# EasyEDA Pro project SK_MFB滤波器.eprj

# Schematic Schematic1
Board Name: Board1; Create Date: 2024-11-27; Page Name: P1; Project Name: SK_MFB滤波器; Schematic Name: Schematic1; Update Date: 2025-03-05; Company: 嘉立创EDA; Page Size: A4; Version: V1.0
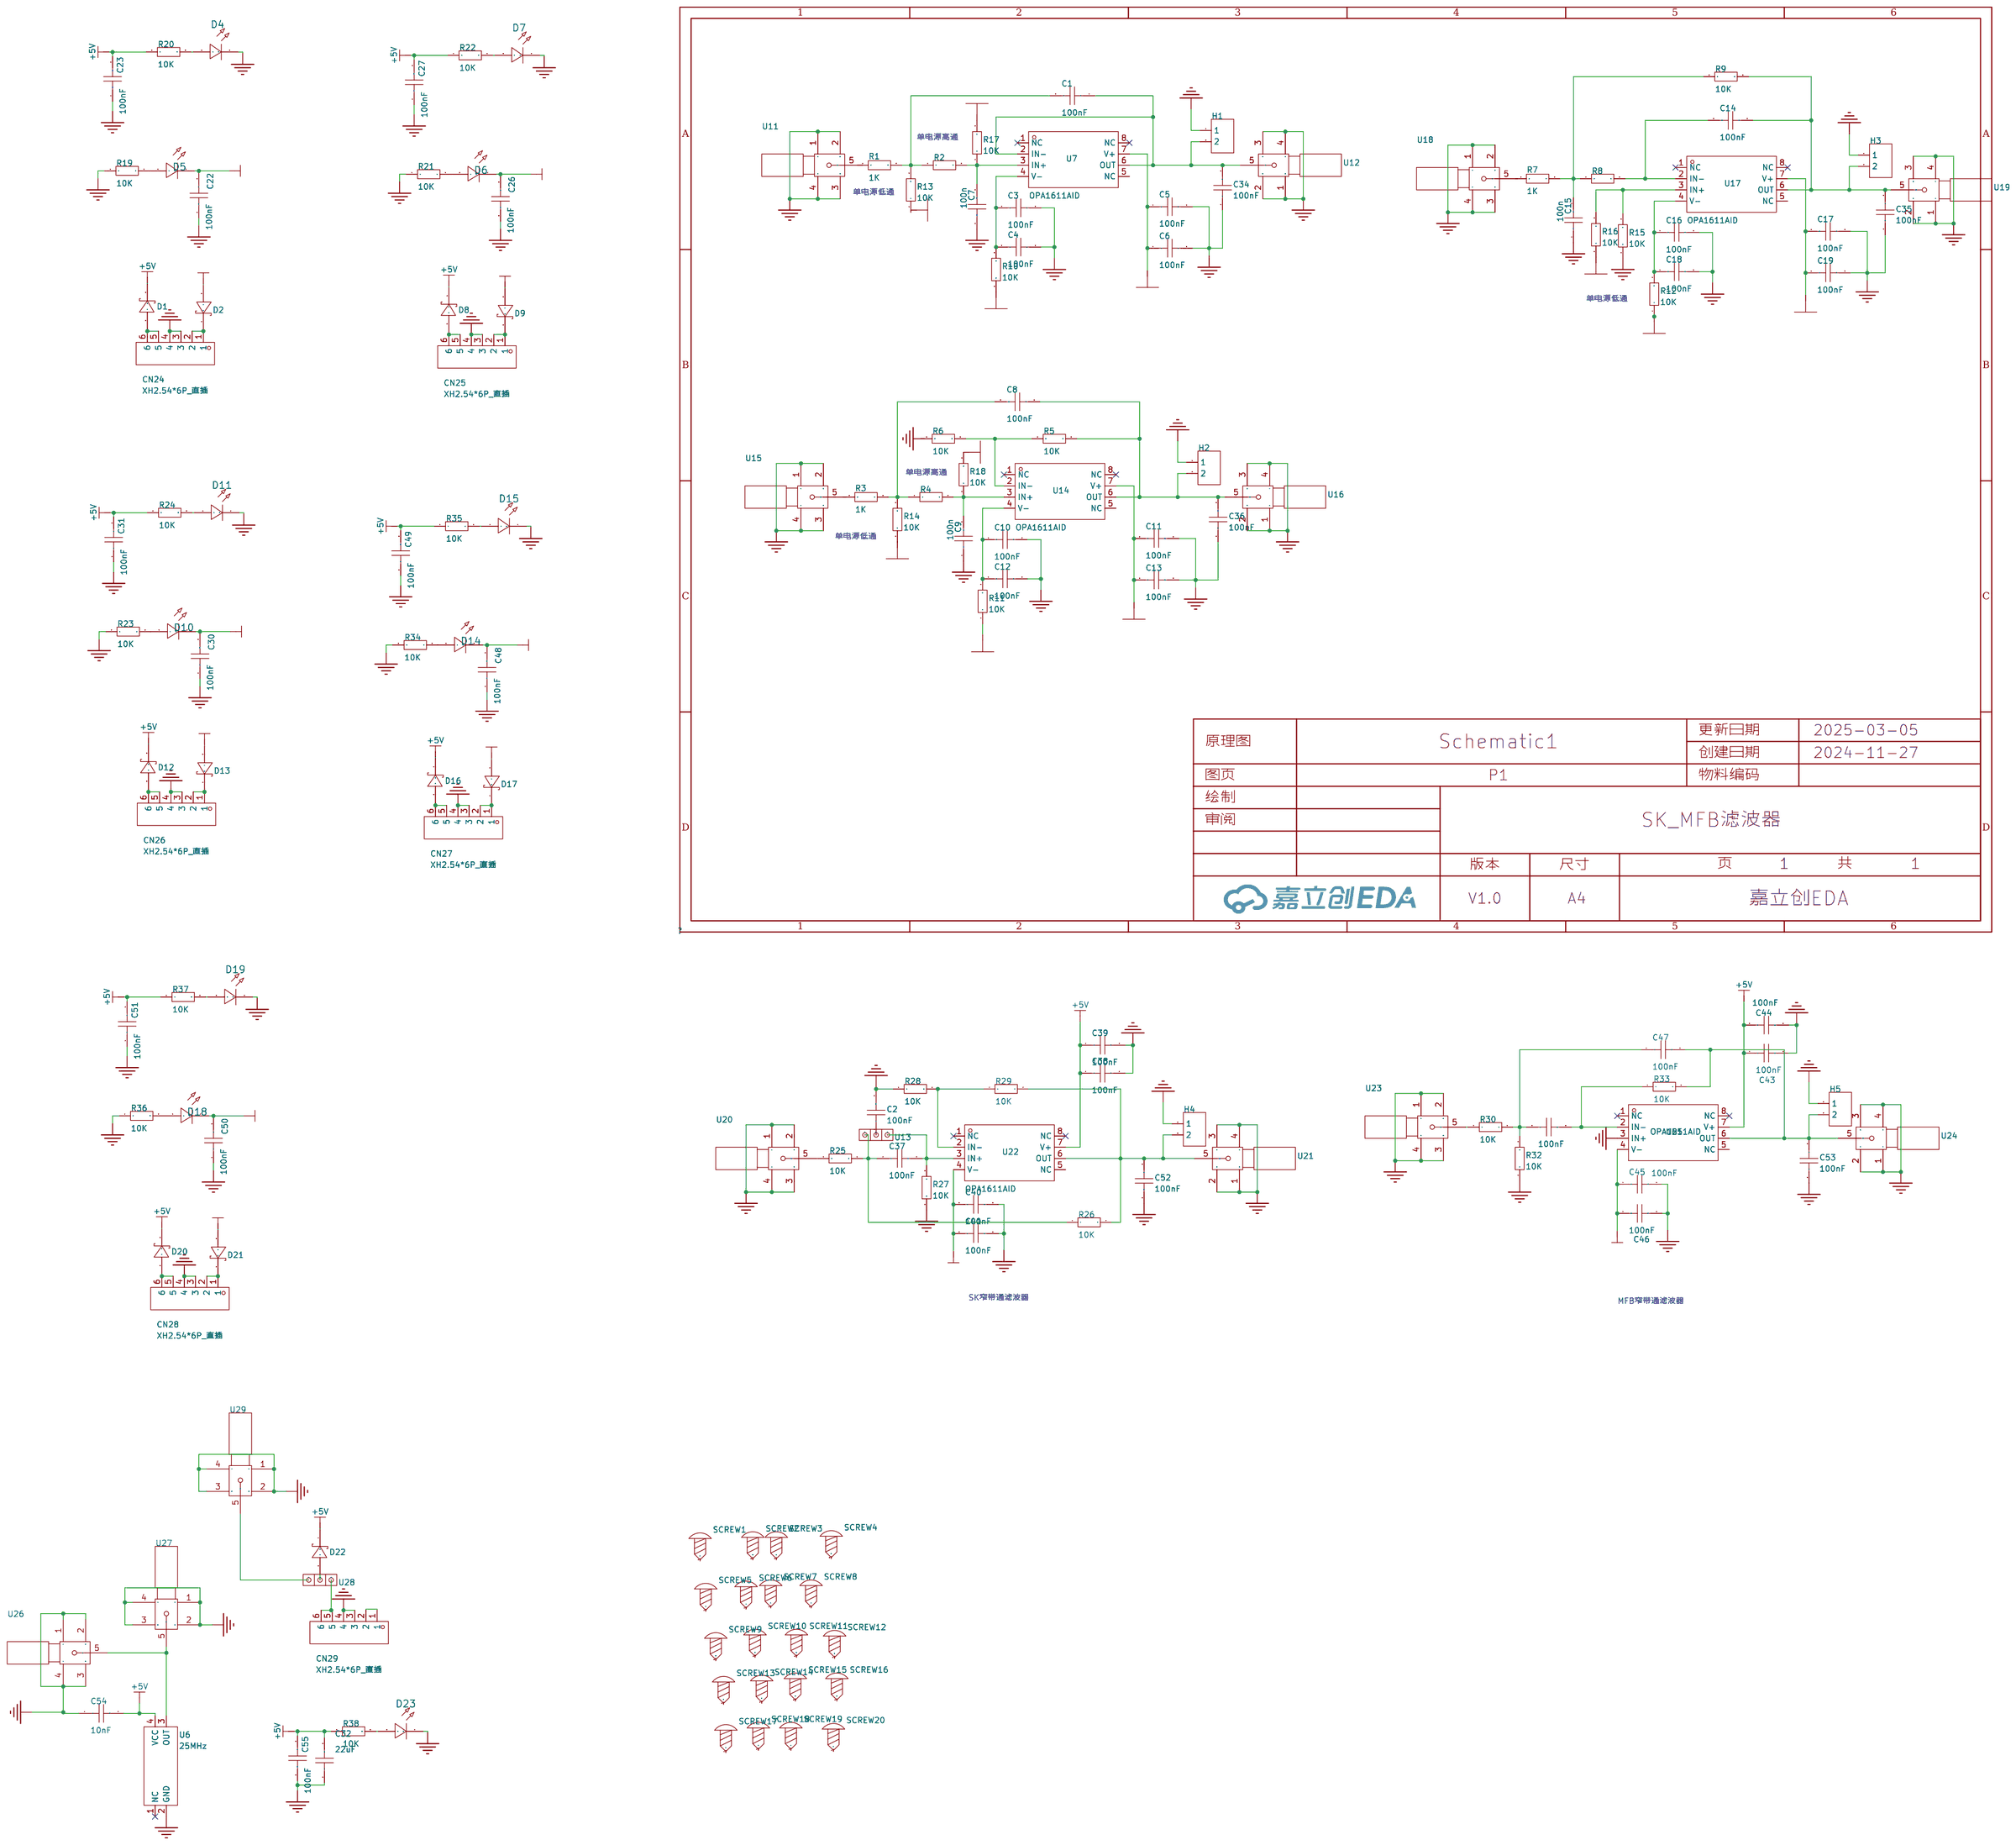
[diagram p0: schematic sheet]

## Parts
C1  100nF  [R0805]
C2  100nF  [R0805]
C3  100nF  [R0805]
C4  100nF  [R0805]
C5  100nF  [R0805]
C6  100nF  [R0805]
C7  100n  [R0805]
C8  100nF  [R0805]
C9  100n  [R0805]
C10  100nF  [R0805]
C11  100nF  [R0805]
C12  100nF  [R0805]
C13  100nF  [R0805]
C14  100nF  [R0805]
C15  100n  [R0805]
C16  100nF  [R0805]
C17  100nF  [R0805]
C18  100nF  [R0805]
C19  100nF  [R0805]
C22  100nF  [R0805]
C23  100nF  [R0805]
C26  100nF  [R0805]
C27  100nF  [R0805]
C30  100nF  [R0805]
C31  100nF  [R0805]
C32  22uF  [C1210]
C34  100nF  [R0805]
C35  100nF  [R0805]
C36  100nF  [R0805]
C37  100nF  [R0805]
C38  100nF  [R0805]
C39  100nF  [R0805]
C40  100nF  [R0805]
C41  100nF  [R0805]
C42  100nF  [R0805]
C43  100nF  [R0805]
C44  100nF  [R0805]
C45  100nF  [R0805]
C46  100nF  [R0805]
C47  100nF  [R0805]
C48  100nF  [R0805]
C49  100nF  [R0805]
C50  100nF  [R0805]
C51  100nF  [R0805]
C52  100nF  [R0805]
C53  100nF  [R0805]
C54  10nF  [R0805]
C55  100nF  [R0805]
CN24  XH2.54*6P_直插  [CONN-TH_XH2.54-6P]
CN25  XH2.54*6P_直插  [CONN-TH_XH2.54-6P]
CN26  XH2.54*6P_直插  [CONN-TH_XH2.54-6P]
CN27  XH2.54*6P_直插  [CONN-TH_XH2.54-6P]
CN28  XH2.54*6P_直插  [CONN-TH_XH2.54-6P]
CN29  XH2.54*6P_直插  [CONN-TH_XH2.54-6P]
D1  SD103AWS  [SOD-323_L1.8-W1.3-LS2.5-RD]
D2  SD103AWS  [SOD-323_L1.8-W1.3-LS2.5-RD]
D4  -  [LED_0805]
D5  -  [LED_0805]
D6  -  [LED_0805]
D7  -  [LED_0805]
D8  SD103AWS  [SOD-323_L1.8-W1.3-LS2.5-RD]
D9  SD103AWS  [SOD-323_L1.8-W1.3-LS2.5-RD]
D10  -  [LED_0805]
D11  -  [LED_0805]
D12  SD103AWS  [SOD-323_L1.8-W1.3-LS2.5-RD]
D13  SD103AWS  [SOD-323_L1.8-W1.3-LS2.5-RD]
D14  -  [LED_0805]
D15  -  [LED_0805]
D16  SD103AWS  [SOD-323_L1.8-W1.3-LS2.5-RD]
D17  SD103AWS  [SOD-323_L1.8-W1.3-LS2.5-RD]
D18  -  [LED_0805]
D19  -  [LED_0805]
D20  SD103AWS  [SOD-323_L1.8-W1.3-LS2.5-RD]
D21  SD103AWS  [SOD-323_L1.8-W1.3-LS2.5-RD]
D22  SD103AWS  [SOD-323_L1.8-W1.3-LS2.5-RD]
D23  -  [LED_0805]
H1  -  [HDR-TH_2P-P2.54-V-F]
H2  -  [HDR-TH_2P-P2.54-V-F]
H3  -  [HDR-TH_2P-P2.54-V-F]
H4  -  [HDR-TH_2P-P2.54-V-F]
H5  -  [HDR-TH_2P-P2.54-V-F]
R1  1K  [R0805]
R2  1K  [R0805]
R3  1K  [R0805]
R4  1K  [R0805]
R5  10K  [R0805]
R6  10K  [R0805]
R7  1K  [R0805]
R8  1K  [R0805]
R9  10K  [R0805]
R10  10K  [R0805]
R11  10K  [R0805]
R12  10K  [R0805]
R13  10K  [R0805]
R14  10K  [R0805]
R15  10K  [R0805]
R16  10K  [R0805]
R17  10K  [R0805]
R18  10K  [R0805]
R19  10K  [R0805]
R20  10K  [R0805]
R21  10K  [R0805]
R22  10K  [R0805]
R23  10K  [R0805]
R24  10K  [R0805]
R25  10K  [R0805]
R26  10K  [R0805]
R27  10K  [R0805]
R28  10K  [R0805]
R29  10K  [R0805]
R30  10K  [R0805]
R32  10K  [R0805]
R33  10K  [R0805]
R34  10K  [R0805]
R35  10K  [R0805]
R36  10K  [R0805]
R37  10K  [R0805]
R38  10K  [R0805]
SCREW1  -  [M3螺丝]
SCREW2  -  [M3螺丝]
SCREW3  -  [M3螺丝]
SCREW4  -  [M3螺丝]
SCREW5  -  [M3螺丝]
SCREW6  -  [M3螺丝]
SCREW7  -  [M3螺丝]
SCREW8  -  [M3螺丝]
SCREW9  -  [M3螺丝]
SCREW10  -  [M3螺丝]
SCREW11  -  [M3螺丝]
SCREW12  -  [M3螺丝]
SCREW13  -  [M3螺丝]
SCREW14  -  [M3螺丝]
SCREW15  -  [M3螺丝]
SCREW16  -  [M3螺丝]
SCREW17  -  [M3螺丝]
SCREW18  -  [M3螺丝]
SCREW19  -  [M3螺丝]
SCREW20  -  [M3螺丝]
U6  25MHz  [OSC-SMD_4P-L7.0-W5.0-BL]
U7  OPA1611AID  [SOIC-8_L4.9-W3.9-P1.27-LS6.0-BL]
U11  -  [SMA]
U12  -  [SMA]
U13  -  [1*3跳线]
U14  OPA1611AID  [SOIC-8_L4.9-W3.9-P1.27-LS6.0-BL]
U15  -  [SMA]
U16  -  [SMA]
U17  OPA1611AID  [SOIC-8_L4.9-W3.9-P1.27-LS6.0-BL]
U18  -  [SMA]
U19  -  [SMA]
U20  -  [SMA]
U21  -  [SMA]
U22  OPA1611AID  [SOIC-8_L4.9-W3.9-P1.27-LS6.0-BL]
U23  -  [SMA]
U24  -  [SMA]
U25  OPA1611AID  [SOIC-8_L4.9-W3.9-P1.27-LS6.0-BL]
U26  -  [SMA]
U27  -  [SMA]
U28  -  [1*3跳线]
U29  -  [SMA]

## Library data of the parts
C1-C19 C22 C23 C26 C27 C30 C31 C34-C55 = CAP_0805: Supplier Footprint: 0805
C32 = CL32B226KAJNNNE: 容值:22uF;精度:±10%;额定电压:25V;材质(温度系数):X7R;; LCSC Part Name: 22uF ±10% 25V; Supplier Part: C309062; Manufacturer: SAMSUNG(三星); Supplier Footprint: 1210; JLCPCB Part Class: 扩展库; Datasheet: https://atta.szlcsc.com/upload/public/pdf/source/20160218/1457707763339.pdf; Supplier: LCSC; Tolerance: ±10%; Voltage Rated: 25V; Temperature Coefficient: X7R
CN24-CN29 = XH2.54*6P_直插: Supplier Part: C9900008614; Supplier Footprint: XH2.54_6P; JLCPCB Part Class: 扩展库; Supplier: LCSC
D1 D2 D8 D9 D12 D13 D16 D17 D20-D22 = SD103AWS_C181207: 正向压降(Vf):600mV@200mA;直流反向耐压(Vr):40V;整流电流:350mA;; LCSC Part Name: 电压:40V 电流:350mA 丝印S4; Supplier Part: C181207; Manufacturer: Hottech(合科泰); Supplier Footprint: SOD-323; JLCPCB Part Class: 扩展库; Datasheet: https://atta.szlcsc.com/upload/public/pdf/source/20240513/4691873FBB9173EFBCF4C6FD4BBA1025.pdf; Supplier: LCSC; Forward Voltage (Vf@If): 600mV@200mA; Reverse Voltage (Vr): 40V; Rectified Current: 350mA
D4-D7 D10 D11 D14 D15 D18 D19 D23 = LED_0805-R: Supplier Footprint: 0805
H1-H5 = HDR-F_2.54_1x2P: Supplier Part: C49661; Supplier Footprint: 插件
R1-R30 R32-R38 = Res_0805: Supplier Footprint: 0805
SCREW1-SCREW20 = M3螺丝: Supplier Footprint: 插件
U6 = CO75H4-25.000-33GDTST: 频率:25MHz;输出模式:HCMOS;工作电压:3.3V;频率稳定度(全温):±50ppm;; LCSC Part Name: 25MHz 3.3V HCMOS +/-10PPM; Supplier Part: C2905361; Manufacturer: HCI(杭晶); Supplier Footprint: SMD7050-4P; JLCPCB Part Class: 扩展库; Datasheet: https://atta.szlcsc.com/upload/public/pdf/source/20220525/8A5D6CFF436A3D6FB5711C1D3D06A199.pdf; Supplier: LCSC; Output Type: HCMOS; Supply Voltage: 3.3V; Frequency Stability(Full temperature range): ±50ppm; Operating Temperature: -40℃~+85℃
U7 U14 U17 U22 U25 = OPA1611AID: Supplier Part: C181405; Manufacturer: TI(德州仪器); Supplier Footprint: SOIC-8; JLCPCB Part Class: 扩展库; Datasheet: https://www.ti.com/cn/lit/gpn/opa1611; Supplier: LCSC; Speaker Channels: 单声道; Operating Temperature: -40℃~+85℃
U11 U12 U15 U16 U18-U21 U23 U24 U26 U27 U29 = SMA
U13 U28 = 1*3跳线

## Nets
+5V: C5.1 C6.1 C11.1 C13.1 C17.1 C19.1 C23.2 C27.2 C31.2 C32.2 C38.1 C39.1 C43.1 C44.1 C49.2 C51.2 C54.2 C55.2 D1.1(C) D8.1(C) D12.1(C) D16.1(C) D20.1(C) D22.1(C) R13.1 R14.1 R16.1 R17.2 R18.2 R20.1 R22.1 R24.1 R35.1 R37.1 R38.1 U6.4(VCC) U7.7(V+) U14.7(V+) U17.7(V+) U22.7(V+) U25.7(V+)
-5V: C22.2 C26.2 C30.2 C40.1 C41.1 C45.1 C46.1 C48.2 C50.2 D2.2(A) D5.1(C) D6.1(C) D9.2(A) D10.1(C) D13.2(A) D14.1(C) D17.2(A) D18.1(C) D21.2(A) R10.1 R11.1 R12.1 U22.4(V-) U25.4(V-)
GND: C2.2 C3.2 C4.2 C5.2 C6.2 C7.1 C9.1 C10.2 C11.2 C12.2 C13.2 C15.1 C16.2 C17.2 C18.2 C19.2 C22.1 C23.1 C26.1 C27.1 C30.1 C31.1 C32.1 C34.1 C35.1 C36.1 C38.2 C39.2 C40.2 C41.2 C43.2 C44.2 C45.2 C46.2 C48.1 C49.1 C50.1 C51.1 C52.1 C53.1 C54.1 C55.1 CN24.3 CN24.4 CN25.3 CN25.4 CN26.3 CN26.4 CN27.3 CN27.4 CN28.3 CN28.4 CN29.3 CN29.4 D4.1(C) D7.1(C) D11.1(C) D15.1(C) D19.1(C) D23.1(C) H1.1 H2.1 H3.1 H4.1 H5.1 R6.1 R15.1 R19.1 R21.1 R23.1 R27.1 R28.1 R32.1 R34.1 R36.1 U6.2(GND) U11.1 U11.2 U11.3 U11.4 U12.1 U12.2 U12.3 U12.4 U15.1 U15.2 U15.3 U15.4 U16.1 U16.2 U16.3 U16.4 U18.1 U18.2 U18.3 U18.4 U19.1 U19.2 U19.3 U19.4 U20.1 U20.2 U20.3 U20.4 U21.1 U21.2 U21.3 U21.4 U23.1 U23.2 U23.3 U23.4 U24.1 U24.2 U24.3 U24.4 U25.3(IN+) U26.1 U26.2 U26.3 U26.4 U27.1 U27.2 U27.3 U27.4 U29.1 U29.2 U29.3 U29.4
$1N3424: C3.1 C4.1 R10.2 U7.4(V-)
$1N4804: C7.2 R2.2 R17.1 U7.3(IN+)
$1N4936: R1.1 U11.5
$1N6332: C1.2 R1.2 R2.1 R13.2
$1N6624: C1.1 C34.2 H1.2 U7.2(IN-) U7.6(OUT) U12.5
$1N7112: R3.1 U15.5
$1N7126: C8.2 R3.2 R4.1 R14.2
$1N7131: C10.1 C12.1 R11.2 U14.4(V-)
$1N7132: C9.2 R4.2 R18.1 U14.3(IN+)
$1N7147: R5.1 R6.2 U14.2(IN-)
$1N7158: C8.1 C36.2 H2.2 R5.2 U14.6(OUT) U16.5
$1N8120: R7.1 U18.5
$1N8133: C15.2 R7.2 R8.1 R9.1
$1N8137: C14.2 R8.2 U17.2(IN-)
$1N8145: C14.1 C35.2 H3.2 R9.2 U17.6(OUT) U19.5
$1N8408: C16.1 C18.1 R12.2 U17.4(V-)
$1N8595: R15.2 R16.2 U17.3(IN+)
$1N9380: CN24.1 CN24.2 D2.1(C)
$1N9382: D4.2(A) R20.2
$1N9385: CN24.5 CN24.6 D1.2(A)
$1N9388: D5.2(A) R19.2
$1N9874: D6.2(A) R21.2
$1N9876: D7.2(A) R22.2
$1N9882: CN25.5 CN25.6 D8.2(A)
$1N9884: CN25.1 CN25.2 D9.1(C)
$1N10335: D10.2(A) R23.2
$1N10337: D11.2(A) R24.2
$1N10343: CN26.5 CN26.6 D12.2(A)
$1N10345: CN26.1 CN26.2 D13.1(C)
$1N11433: C42.2 R33.1 U25.2(IN-)
$1N11438: C42.1 C47.1 R30.2 R32.2
$1N11444: R30.1 U23.5
$1N11467: C47.2 C53.2 H5.2 R33.2 U24.5 U25.6(OUT)
$1N11477: C37.1 R25.2 R26.1 U13.1
$1N11484: R28.2 R29.1 U22.2(IN-)
$1N11488: C52.2 H4.2 R26.2 R29.2 U21.5 U22.6(OUT)
$1N11503: C37.2 R27.2 U13.3 U22.3(IN+)
$1N11520: C2.1 U13.2
$1N11527: R25.1 U20.5
$1N11915: CN27.5 CN27.6 D16.2(A)
$1N11916: CN27.1 CN27.2 D17.1(C)
$1N11925: D14.2(A) R34.2
$1N11929: D15.2(A) R35.2
$1N12302: CN28.5 CN28.6 D20.2(A)
$1N12303: CN28.1 CN28.2 D21.1(C)
$1N12312: D18.2(A) R36.2
$1N12316: D19.2(A) R37.2
$1N18614: D23.2(A) R38.2
$1N18618: CN29.1 CN29.2
$1N18622: U6.3(OUT) U26.5 U27.5
$1N18772: CN29.5 CN29.6 U28.3
$1N18775: D22.2(A) U28.2
$1N18865: U28.1 U29.5

Not connected (* = marked no-connect by the designer): SCREW1 1; SCREW2 1; SCREW3 1; SCREW4 1; SCREW5 1; SCREW6 1; SCREW7 1; SCREW8 1; SCREW9 1; SCREW10 1; SCREW11 1; SCREW12 1; SCREW13 1; SCREW14 1; SCREW15 1; SCREW16 1; SCREW17 1; SCREW18 1; SCREW19 1; SCREW20 1; U6 1(NC)*; U7 1(NC)* 5(NC) 8(NC)*; U14 1(NC)* 5(NC) 8(NC)*; U17 1(NC)* 5(NC) 8(NC)*; U22 1(NC)* 5(NC) 8(NC)*; U25 1(NC)* 5(NC) 8(NC)*

## Notes on the sheet
- 单电源高通
- 单电源低通
- 单电源低通
- 单电源高通
- 单电源低通
- SK窄带通滤波器
- MFB窄带通滤波器

# Board PCB1
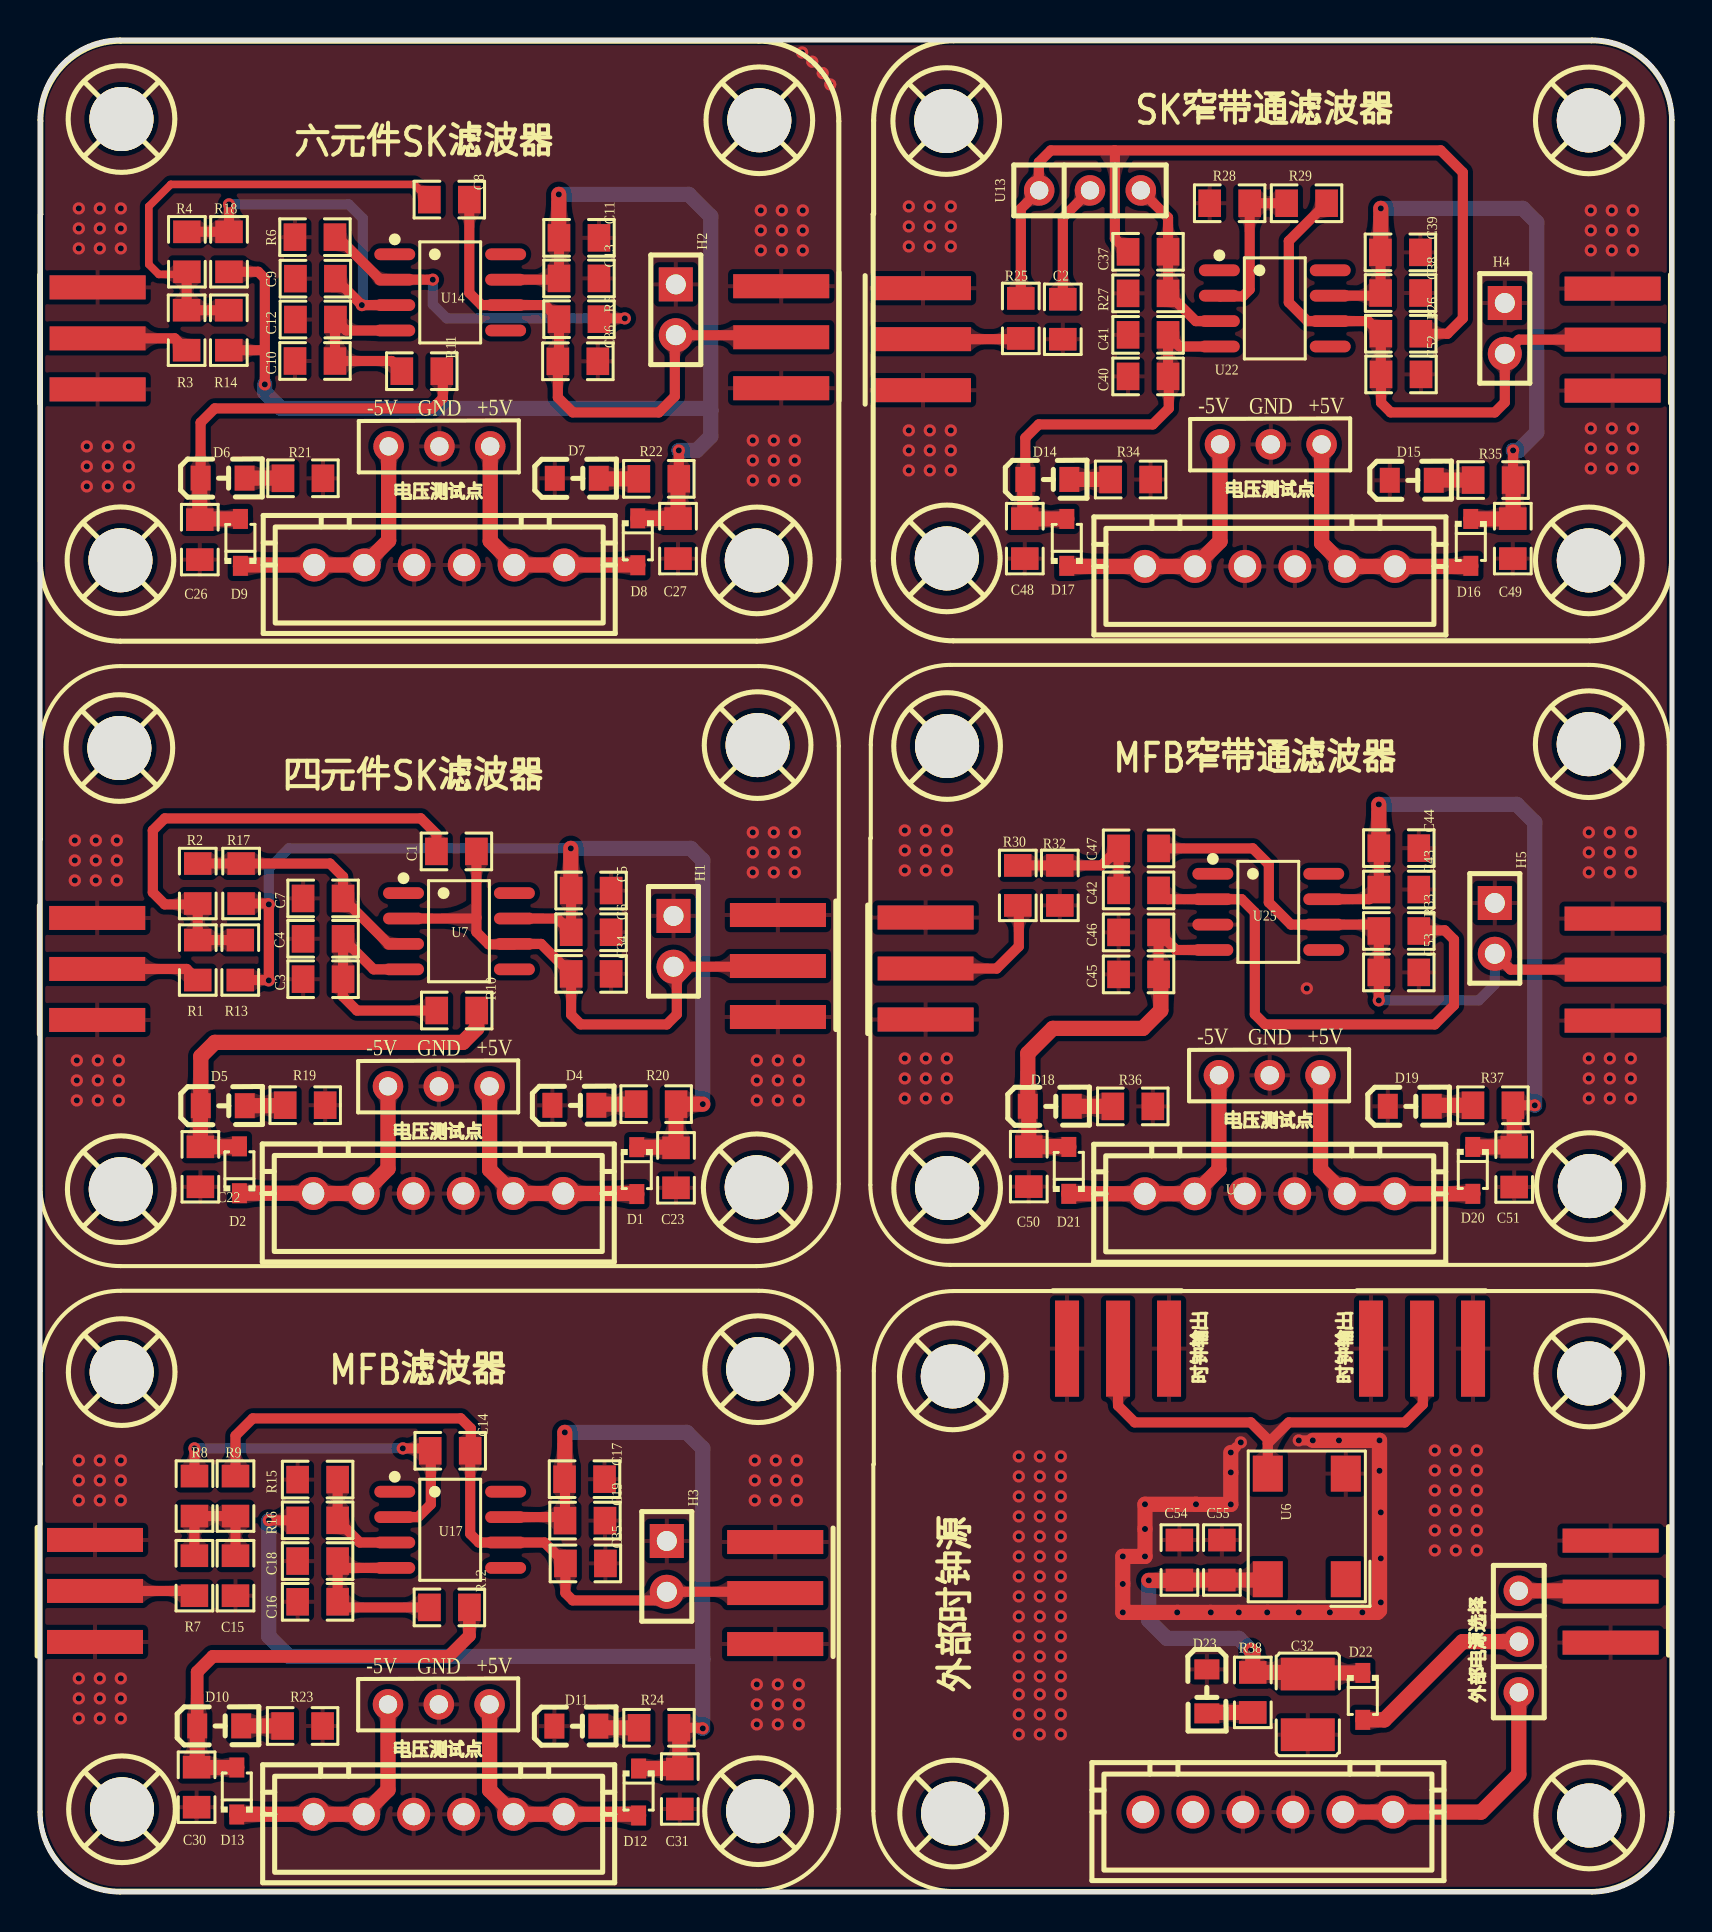
[diagram p1: board, top side]
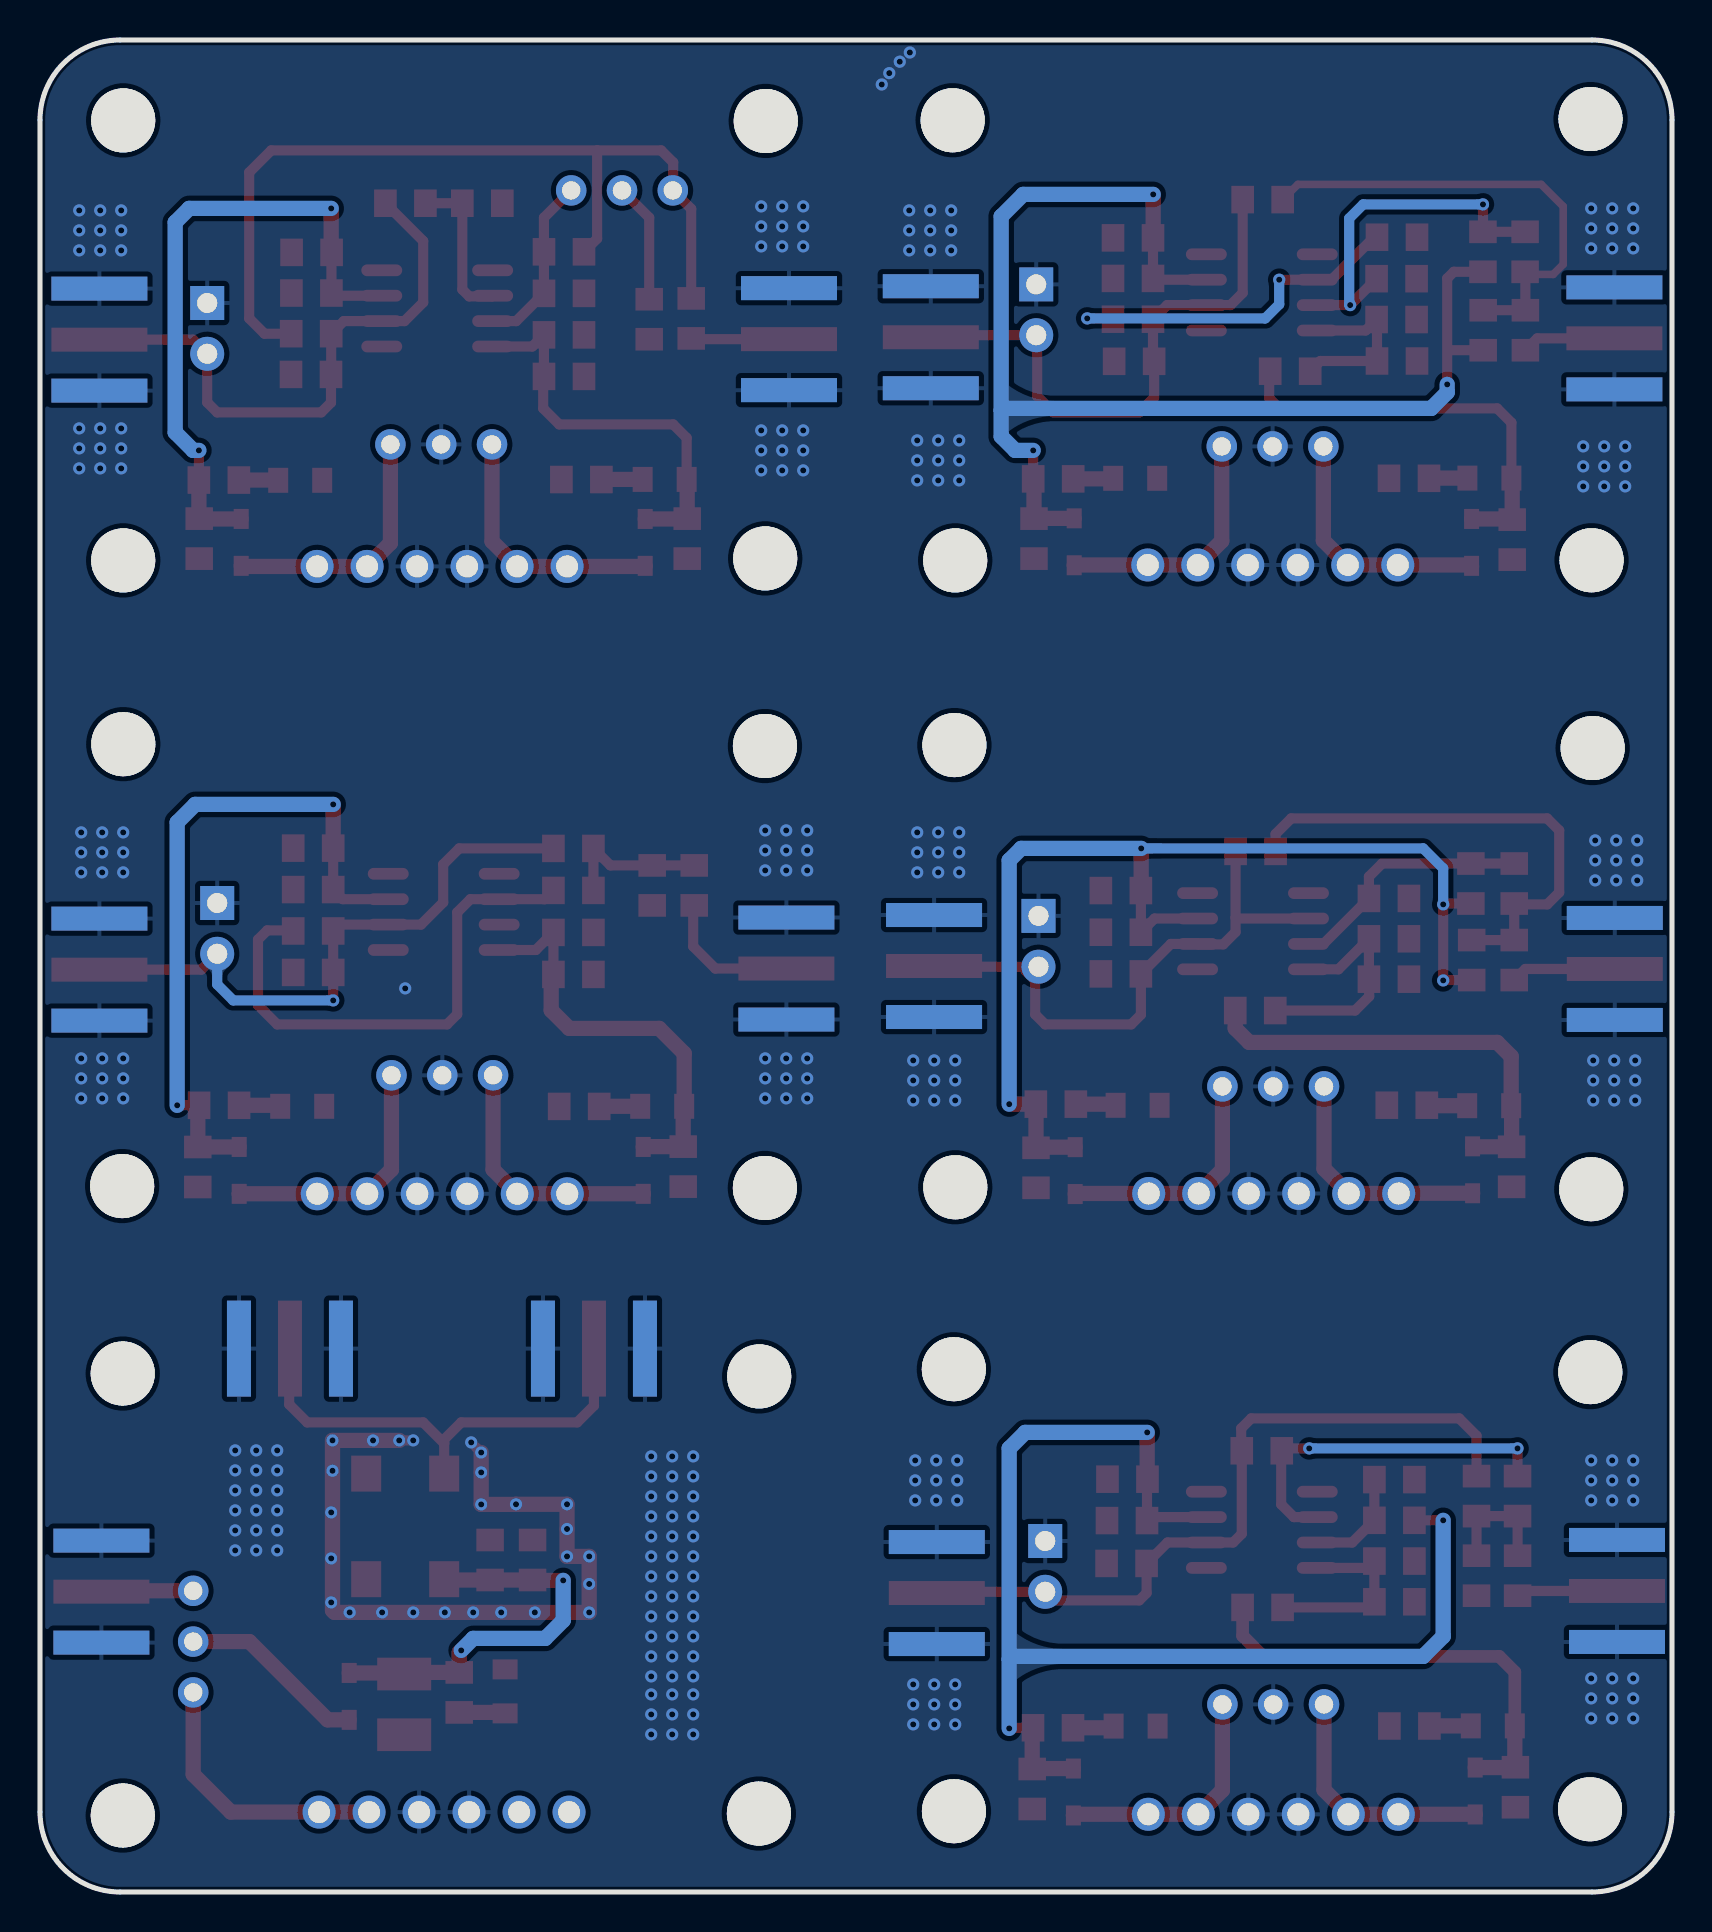
[diagram p2: board, bottom side, seen from below]

Outline 81.6 x 92.6 mm; copper layers: Top Layer, Bottom Layer. Coordinates in mm from the lower left corner of the outline.
Outline path: 0,88.6 0,4 arc(1.17,1.17) 4,0 77.6,0 arc(80.43,1.17) 81.6,4 81.6,88.6 arc(80.43,91.43) 77.6,92.6 4,92.6 arc(1.17,91.43) 0,88.6
Stack: Top Layer 0.035mm / Dielectric1 1.51mm FR4 er 4.5 / Bottom Layer 0.035mm

## Design rules (mm)
template: 自定义配置
spacing copperThickness1oz (default): track to track 0.102, other pairs 0 to 0.3
spacing copperThickness2oz: track to track 0.203, other pairs 0.152 to 0.3
track width copperThickness1oz (default): min 0.127, default 0.508, max 2.54
track width copperThickness2oz: min 0.203, default 0.254, max 2.54
differential pair differentialPair (default): width min 0.127, default 0.254, max 2.54; gap min 0.152, default 0.152
via viaSize (default): diameter min 0.5, default 0.61, max 10; hole min 0.3, default 0.305, max 6.299

## Placement (name value [footprint] x y rotation side)
C1  100nF  [R0805]  20.71 52.03 180 top
C2  100nF  [R0805]  51.14 78.53 270 top
C3  100nF  [R0805]  14.04 45.64 180 top
C4  100nF  [R0805]  14.04 47.66 180 top
C5  100nF  [R0805]  27.67 50.07 0 top
C6  100nF  [R0805]  27.67 47.99 0 top
C7  100n  [R0805]  14.26 49.68 0 top
C8  100nF  [R0805]  20.35 84.62 180 top
C9  100n  [R0805]  13.88 80.67 0 top
C10  100nF  [R0805]  13.64 76.55 180 top
C11  100nF  [R0805]  27.06 82.71 0 top
C12  100nF  [R0805]  13.66 78.62 180 top
C13  100nF  [R0805]  27.06 80.68 0 top
C14  100nF  [R0805]  20.4 22.06 180 top
C15  100n  [R0805]  9.77 15.93 90 top
C16  100nF  [R0805]  13.77 14.51 180 top
C17  100nF  [R0805]  27.34 20.64 0 top
C18  100nF  [R0805]  13.77 16.55 180 top
C19  100nF  [R0805]  27.36 18.57 0 top
C22  100nF  [R0805]  8.02 36.37 90 top
C23  100nF  [R0805]  31.8 36.32 90 top
C26  100nF  [R0805]  7.99 67.73 90 top
C27  100nF  [R0805]  31.9 67.78 90 top
C30  100nF  [R0805]  7.83 5.35 90 top
C31  100nF  [R0805]  31.99 5.26 90 top
C32  22uF  [C1210]  63.39 9.38 90 top
C34  100nF  [R0805]  27.44 45.9 180 top
C35  100nF  [R0805]  27.16 16.43 180 top
C36  100nF  [R0805]  26.78 76.54 180 top
C37  100nF  [R0805]  55.51 82.01 0 top
C38  100nF  [R0805]  68.14 79.95 0 top
C39  100nF  [R0805]  68.13 81.98 0 top
C40  100nF  [R0805]  55.29 75.78 180 top
C41  100nF  [R0805]  55.29 77.86 180 top
C42  100nF  [R0805]  55.04 50.08 0 top
C43  100nF  [R0805]  68.05 50.12 0 top
C44  100nF  [R0805]  68.05 52.19 0 top
C45  100nF  [R0805]  54.82 45.88 180 top
C46  100nF  [R0805]  54.82 47.98 180 top
C47  100nF  [R0805]  55.04 52.18 0 top
C48  100nF  [R0805]  49.24 67.78 90 top
C49  100nF  [R0805]  73.64 67.78 90 top
C50  100nF  [R0805]  49.44 36.38 90 top
C51  100nF  [R0805]  73.71 36.36 90 top
C52  100nF  [R0805]  67.94 75.88 180 top
C53  100nF  [R0805]  67.83 45.98 180 top
C54  10nF  [R0805]  56.97 16.49 270 top
C55  100nF  [R0805]  59.1 16.49 270 top
CN24  XH2.54*6P_直插  [CONN-TH_XH2.54-6P]  19.91 34.93 0 top
CN25  XH2.54*6P_直插  [CONN-TH_XH2.54-6P]  19.96 66.35 0 top
CN26  XH2.54*6P_直插  [CONN-TH_XH2.54-6P]  19.93 3.89 0 top
CN27  XH2.54*6P_直插  [CONN-TH_XH2.54-6P]  61.5 66.28 0 top
CN28  XH2.54*6P_直插  [CONN-TH_XH2.54-6P]  61.49 34.91 0 top
CN29  XH2.54*6P_直插  [CONN-TH_XH2.54-6P]  61.4 4 0 top
D1  SD103AWS  [SOD-323_L1.8-W1.3-LS2.5-RD]  29.84 36.07 270 top
D2  SD103AWS  [SOD-323_L1.8-W1.3-LS2.5-RD]  9.97 36.11 90 top
D4  -  [LED_0805]  26.77 39.33 0 top
D5  -  [LED_0805]  9.19 39.31 0 top
D6  -  [LED_0805]  9.18 70.69 0 top
D7  -  [LED_0805]  26.89 70.68 0 top
D8  SD103AWS  [SOD-323_L1.8-W1.3-LS2.5-RD]  29.89 67.51 270 top
D9  SD103AWS  [SOD-323_L1.8-W1.3-LS2.5-RD]  10.02 67.48 90 top
D10  -  [LED_0805]  9.01 8.3 0 top
D11  -  [LED_0805]  26.87 8.29 0 top
D12  SD103AWS  [SOD-323_L1.8-W1.3-LS2.5-RD]  29.93 5 270 top
D13  SD103AWS  [SOD-323_L1.8-W1.3-LS2.5-RD]  9.84 5.05 90 top
D14  -  [LED_0805]  50.42 70.62 0 top
D15  -  [LED_0805]  68.64 70.58 0 top
D16  SD103AWS  [SOD-323_L1.8-W1.3-LS2.5-RD]  71.54 67.48 270 top
D17  SD103AWS  [SOD-323_L1.8-W1.3-LS2.5-RD]  51.34 67.48 90 top
D18  -  [LED_0805]  50.54 39.28 0 top
D19  -  [LED_0805]  68.54 39.28 0 top
D20  SD103AWS  [SOD-323_L1.8-W1.3-LS2.5-RD]  71.64 36.08 270 top
D21  SD103AWS  [SOD-323_L1.8-W1.3-LS2.5-RD]  51.44 36.08 90 top
D22  SD103AWS  [SOD-323_L1.8-W1.3-LS2.5-RD]  66.14 9.78 270 top
D23  -  [LED_0805]  58.34 9.98 270 top
H1  -  [HDR-TH_2P-P2.54-V-F]  31.68 47.53 270 top
H2  -  [HDR-TH_2P-P2.54-V-F]  31.79 79.11 270 top
H3  -  [HDR-TH_2P-P2.54-V-F]  31.34 16.28 270 top
H4  -  [HDR-TH_2P-P2.54-V-F]  73.24 78.18 270 top
H5  -  [HDR-TH_2P-P2.54-V-F]  72.74 48.18 270 top
NOREF  -  [Pad_e147]  17.43 72.28 0 top
NOREF#2  -  [Pad_e213]  64.08 72.38 0 top
NOREF#3  -  [Pad_e251]  61.49 40.84 0 top
NOREF#4  -  [Pad_e252]  64.03 40.84 0 top
NOREF#5  -  [Pad_e211]  59 72.38 0 top
NOREF#6  -  [Pad_e212]  61.54 72.38 0 top
NOREF#7  -  [Pad_e195]  17.4 40.28 0 top
NOREF#8  -  [Pad_e196]  19.94 40.28 0 top
NOREF#9  -  [Pad_e250]  58.95 40.84 0 top
NOREF#10  -  [Pad_e203]  17.4 9.38 0 top
NOREF#11  -  [Pad_e154]  22.51 72.28 0 top
NOREF#12  -  [Pad_e197]  22.48 40.28 0 top
NOREF#13  -  [Pad_e205]  22.48 9.38 0 top
NOREF#14  -  [Pad_e146]  19.97 72.28 0 top
NOREF#15  -  [Pad_e204]  19.94 9.38 0 top
R1  1K  [R0805#2]  7.89 46.6 90 top
R2  1K  [R0805#2]  7.89 50.42 90 top
R3  1K  [R0805#2]  7.33 78.09 90 top
R4  1K  [R0805#2]  7.34 82.01 90 top
R5  10K  [R0805#2]  26.95 78.64 180 top
R6  10K  [R0805#2]  13.75 82.74 0 top
R7  1K  [R0805#2]  7.72 15.81 90 top
R8  1K  [R0805#2]  7.72 19.8 90 top
R9  10K  [R0805#2]  9.77 19.8 90 top
R10  10K  [R0805#2]  20.84 44.07 180 top
R11  10K  [R0805#2]  19.09 76.04 180 top
R12  10K  [R0805#2]  20.47 14.23 180 top
R13  10K  [R0805#2]  10.01 46.6 90 top
R14  10K  [R0805#2]  9.44 78.09 90 top
R15  10K  [R0805#2]  13.88 20.62 0 top
R16  10K  [R0805#2]  13.88 18.58 0 top
R17  10K  [R0805#2]  10.05 50.42 270 top
R18  10K  [R0805#2]  9.45 82.01 270 top
R19  10K  [R0805#2]  13.26 39.34 180 top
R20  10K  [R0805#2]  30.81 39.39 180 top
R21  10K  [R0805#2]  13.15 70.69 180 top
R22  10K  [R0805#2]  30.94 70.66 180 top
R23  10K  [R0805#2]  13.13 8.3 180 top
R24  10K  [R0805#2]  30.95 8.21 180 top
R25  10K  [R0805#2]  49.04 78.68 90 top
R26  10K  [R0805#2]  68.04 77.91 180 top
R27  10K  [R0805#2]  55.4 79.93 0 top
R28  10K  [R0805#2]  59.48 84.44 0 top
R29  10K  [R0805#2]  63.33 84.44 0 top
R30  10K  [R0805#2]  48.89 50.33 90 top
R32  10K  [R0805#2]  50.99 50.33 90 top
R33  10K  [R0805#2]  67.94 48.05 180 top
R34  10K  [R0805#2]  54.53 70.62 180 top
R35  10K  [R0805#2]  72.66 70.6 180 top
R36  10K  [R0805#2]  54.64 39.28 180 top
R37  10K  [R0805#2]  72.65 39.33 180 top
R38  10K  [R0805#2]  60.64 9.98 270 top
SCREW1  -  [M3螺丝]  35.97 88.59 0 top
SCREW2  -  [M3螺丝]  35.9 4.04 0 top
SCREW2#2  -  [M3螺丝]  77.46 3.83 0 top
SCREW3  -  [M3螺丝]  4.04 35.14 0 top
SCREW4  -  [M3螺丝]  4.08 25.99 0 top
SCREW4#2  -  [M3螺丝]  45.64 25.78 0 top
SCREW5  -  [M3螺丝]  35.84 35.24 0 top
SCREW6  -  [M3螺丝]  35.88 57.34 0 top
SCREW7  -  [M3螺丝]  3.97 57.2 0 top
SCREW8  -  [M3螺丝]  35.84 66.58 0 top
SCREW9  -  [M3螺丝]  4.02 66.59 0 top
SCREW10  -  [M3螺丝]  45.31 88.55 0 top
SCREW11  -  [M3螺丝]  45.34 66.68 0 top
SCREW12  -  [M3螺丝]  77.44 66.58 0 top
SCREW13  -  [M3螺丝]  4.1 4.14 0 top
SCREW13#2  -  [M3螺丝]  45.66 3.92 0 top
SCREW14  -  [M3螺丝]  77.44 57.39 0 top
SCREW15  -  [M3螺丝]  45.36 35.2 0 top
SCREW16  -  [M3螺丝]  45.35 57.3 0 top
SCREW17  -  [M3螺丝]  35.91 26.14 0 top
SCREW17#2  -  [M3螺丝]  77.46 25.93 0 top
SCREW18  -  [M3螺丝]  4.07 88.65 0 top
SCREW19  -  [M3螺丝]  77.44 88.58 0 top
SCREW20  -  [M3螺丝]  77.49 35.29 0 top
U6  25MHz  [OSC-SMD_4P-L7.0-W5.0-BL]  63.34 18.28 90 top
U7  OPA1611AID  [SOIC-8_L4.9-W3.9-P1.27-LS6.0-BL]  20.95 48.04 270 top
U11  -  [SMA]  -0.95 40.29 0 top
U12  -  [SMA]  40.71 52.16 180 top
U13  -  [1*3跳线]  55.04 85.08 90 top
U14  OPA1611AID  [SOIC-8_L4.9-W3.9-P1.27-LS6.0-BL]  20.51 79.98 270 top
U15  -  [SMA]  -0.93 71.82 0 top
U16  -  [SMA]  40.87 83.6 180 top
U17  OPA1611AID  [SOIC-8_L4.9-W3.9-P1.27-LS6.0-BL]  20.51 18.11 270 top
U18  -  [SMA]  -1.06 9.19 0 top
U19  -  [SMA]  40.57 20.81 180 top
U20  -  [SMA]  40.34 71.78 0 top
U21  -  [SMA]  82.44 83.48 180 top
U22  OPA1611AID  [SOIC-8_L4.9-W3.9-P1.27-LS6.0-BL]  61.74 79.18 270 top
U23  -  [SMA]  40.47 40.31 0 top
U24  -  [SMA]  82.44 51.98 180 top
U25  OPA1611AID  [SOIC-8_L4.9-W3.9-P1.27-LS6.0-BL]  61.41 49.01 270 top
U26  -  [SMA]  48.04 30.98 270 top
U27  -  [SMA]  63.24 30.98 270 top
U28  -  [1*3跳线]  73.94 9.98 0 top
U29  -  [SMA]  82.34 20.88 180 top

## Footprints (pads in the part's own frame, mm; a bottom-side part is the same pattern mirrored in y, then rotated)
1*3跳线
  round 1.524 hole 0.914: 1(0,5.08) 2(0,2.54) 3(0,0)
C1210
  rect 1.635x2.7 smd: 1(-1.518,0) 2(1.518,0)
CONN-TH_XH2.54-6P
  round 1.65 hole 1.1: 1(-6.25,0) 2(-3.75,0) 3(-1.25,0) 4(1.25,0) 5(3.75,0) 6(6.25,0)
HDR-TH_2P-P2.54-V-F
  rect 1.7x1.7 hole 1: 1(-1.27,0)
  round 1.7 hole 1: 2(1.27,0)
LED_0805
  rect 1x1.25 smd: 1(-1.15,0.005) 2(1.05,0.005)
M3螺丝
  round 3.2 hole 3.2: 1(0,0)
OSC-SMD_4P-L7.0-W5.0-BL
  rect 1.8x1.5 smd: 1(-2.64,-1.95) 2(2.64,-1.95) 3(2.64,1.95) 4(-2.64,1.95)
Pad_e146
  round 1.524 hole 0.914: 1(0,0)
Pad_e147
  round 1.524 hole 0.914: 2(0,0)
Pad_e154
  round 1.524 hole 0.914: 3(0,0)
Pad_e195
  round 1.524 hole 0.914: 2(0,0)
Pad_e196
  round 1.524 hole 0.914: 1(0,0)
Pad_e197
  round 1.524 hole 0.914: 3(0,0)
Pad_e203
  round 1.524 hole 0.914: 2(0,0)
Pad_e204
  round 1.524 hole 0.914: 1(0,0)
Pad_e205
  round 1.524 hole 0.914: 3(0,0)
Pad_e211
  round 1.524 hole 0.914: 2(0,0)
Pad_e212
  round 1.524 hole 0.914: 1(0,0)
Pad_e213
  round 1.524 hole 0.914: 3(0,0)
Pad_e250
  round 1.524 hole 0.914: 2(0,0)
Pad_e251
  round 1.524 hole 0.914: 1(0,0)
Pad_e252
  round 1.524 hole 0.914: 3(0,0)
R0805
  rect 1.133x1.377 smd: 1(-1.111,0) 2(0.889,0)
R0805#2
  rect 1.133x1.377 smd: 1(-1,0) 2(1,0)
SMA
  rect 4.8x1.2 smd: 1(3.81,8.412) 2(3.81,3.312) 5(3.81,5.862)
  rect 4.8x1.2 smd far side: 3(3.81,3.312) 4(3.81,8.412)
SOD-323_L1.8-W1.3-LS2.5-RD
  rect 1x0.75 smd: 1(-1.173,0) 2(1.173,0)
SOIC-8_L4.9-W3.9-P1.27-LS6.0-BL
  oval 0.588x2.045 smd: 1(-1.905,-2.772) 2(-0.635,-2.772) 3(0.635,-2.772) 4(1.905,-2.772) 5(1.905,2.772) 6(0.635,2.772) 7(-0.635,2.772) 8(-1.905,2.772)

## Nets
As in the schematic, except:
GND: C2.2 C3.2 C4.2 C5.2 C6.2 C7.1 C9.1 C10.2 C11.2 C12.2 C13.2 C15.1 C16.2 C17.2 C18.2 C19.2 C22.1 C23.1 C26.1 C27.1 C30.1 C31.1 C32.1 C34.1 C35.1 C36.1 C38.2 C39.2 C40.2 C41.2 C43.2 C44.2 C45.2 C46.2 C48.1 C49.1 C50.1 C51.1 C52.1 C53.1 C54.1 C55.1 CN24.3 CN24.4 CN25.3 CN25.4 CN26.3 CN26.4 CN27.3 CN27.4 CN28.3 CN28.4 CN29.3 CN29.4 D4.1 D7.1 D11.1 D15.1 D19.1 D23.1 H1.1 H2.1 H3.1 H4.1 H5.1 NOREF#3.1 NOREF#6.1 NOREF#8.1 NOREF#14.1 NOREF#15.1 R6.1 R15.1 R19.1 R21.1 R23.1 R27.1 R28.1 R32.1 R34.1 R36.1 U6.2 U11.1 U11.2 U11.3 U11.4 U12.1 U12.2 U12.3 U12.4 U15.1 U15.2 U15.3 U15.4 U16.1 U16.2 U16.3 U16.4 U18.1 U18.2 U18.3 U18.4 U19.1 U19.2 U19.3 U19.4 U20.1 U20.2 U20.3 U20.4 U21.1 U21.2 U21.3 U21.4 U23.1 U23.2 U23.3 U23.4 U24.1 U24.2 U24.3 U24.4 U25.3 U26.1 U26.2 U26.3 U26.4 U27.1 U27.2 U27.3 U27.4 U29.1 U29.2 U29.3 U29.4
$1N9380: CN24.1 CN24.2 D2.1 NOREF#7.2
$1N9385: CN24.5 CN24.6 D1.2 NOREF#12.3
$1N9882: CN25.5 CN25.6 D8.2 NOREF#11.3
$1N9884: CN25.1 CN25.2 D9.1 NOREF.2
$1N10343: CN26.5 CN26.6 D12.2 NOREF#13.3
$1N10345: CN26.1 CN26.2 D13.1 NOREF#10.2
$1N11915: CN27.5 CN27.6 D16.2 NOREF#2.3
$1N11916: CN27.1 CN27.2 D17.1 NOREF#5.2
$1N12302: CN28.5 CN28.6 D20.2 NOREF#4.3
$1N12303: CN28.1 CN28.2 D21.1 NOREF#9.2

Pads without a net: SCREW1 1; SCREW2 1; SCREW2#2 1; SCREW3 1; SCREW4 1; SCREW4#2 1; SCREW5 1; SCREW6 1; SCREW7 1; SCREW8 1; SCREW9 1; SCREW10 1; SCREW11 1; SCREW12 1; SCREW13 1; SCREW13#2 1; SCREW14 1; SCREW15 1; SCREW16 1; SCREW17 1; SCREW17#2 1; SCREW18 1; SCREW19 1; SCREW20 1; U6 1; U7 1 5 8; U14 1 5 8; U17 1 5 8; U22 1 5 8; U25 1 5 8

## Via types
v1: diameter 0.61, hole 0.305, Top Layer to Bottom Layer, 297 vias

## Routing (per net, layer and track width the routed paths; a pad name or vN(x,y) marks a point on that pad's centre or on a via; arc(x,y) is an arc through that point)
+5V: length 272.1
  Top Layer w0.508: U14.7 25.88,80.62 C13.1 C11.1 ; U25.7 66.46,49.64 C43.1 66.94,51.94 ; R16.1 v1(11.44,18.58) ; R17.2 11.4,49.42 v1(11.44,49.38) v1(11.44,45.58) 11.42,45.6 R13.1 ; C17.1 26.25,20.62 C19.1 26.07,18.75 U17.7 ; R35.1 v1(73.66,72.08) ; v1(11.24,75.38) 11.24,80.68 10.91,81.01 R18.2 ; U22.7 66.9,79.82 C38.1 67.03,81.97 C39.1 ; R37.1 v1(74.74,39.33) ; v1(33.14,8.18) 33.11,8.21 R24.1 ; R14.1 11.04,77.09 ; R22.1 v1(31.94,72.08) ; C5.1 C6.1 25.87,48.67 U7.7
  Top Layer w0.762: v1(26.54,52.18) 26.54,50.09 C5.1 ; D12.1 31.97,6.17 31.99,6.15 31.99,8.17 R24.1 ; 66.94,51.94 C44.1 v1(66.94,54.38) ; D22.1 63.45,10.95 C32.2 63.31,10.98 R38.1 60.64,11.98 v1(60.54,12.08) ; U6.4 61.35,15.6 C55.2 C54.2 56.95,15.58 v1(55.44,15.58) ; D8.1 31.89,68.68 arc(31.9,68.68) C27.2 31.9,70.62 arc(31.91,70.65) R22.1 ; R37.1 73.71,39.27 C51.2 73.7,37.25 D20.1 ; v1(26.24,22.98) 26.24,20.65 C17.1 ; v1(67.04,84.18) 67.04,82 C39.1 ; D16.1 73.62,68.65 C49.2 73.66,68.68 R35.1 ; v1(25.94,84.88) 25.94,82.72 C11.1 ; D1.1 31.77,37.24 C23.2 31.8,39.38 R20.1 v1(33.14,39.39)
  Bottom Layer w0.508: v1(26.54,52.18) 12.44,52.18 11.44,51.18 v1(11.44,49.38)
  Bottom Layer w0.762: v1(60.54,12.08) 59.94,12.68 56.34,12.68 55.44,13.58 v1(55.44,15.58) ; v1(11.24,75.38) 11.24,74.98 12.04,74.18 33.45,74.18 33.54,74.09 ; 33.14,11.64 33,11.78 12.44,11.78 11.44,12.78 v1(11.44,18.58) ; 33.14,11.64 33.14,22.18 32.34,22.98 v1(26.24,22.98) ; 33.14,11.64 v1(33.14,8.18) ; 33.54,74.09 33.54,72.78 32.84,72.08 v1(31.94,72.08) ; 33.54,74.09 33.54,83.78 32.44,84.88 v1(25.94,84.88) ; v1(26.54,52.18) 32.54,52.18 33.14,51.58 v1(33.14,39.39) ; v1(66.94,54.38) 73.84,54.38 74.74,53.48 v1(74.74,39.33) ; v1(73.66,72.08) 73.94,72.08 74.84,72.98 74.84,83.48 74.14,84.18 v1(67.04,84.18)
-5V: length 106.9
  Top Layer w0.508: C45.1 C46.1 56.81,47.1 U25.4 ; D14.1 49.27,72.71 49.94,73.38 55.64,73.38 56.44,74.18 56.44,75.74 C40.1 C41.1 56.98,77.28 U22.4 ; D6.1 8.03,73.47 8.74,74.18 19.63,74.18 20.14,74.69 20.14,76
  Top Layer w0.635: D10.1 7.86,11 8.64,11.78 20.44,11.78 21.47,12.81 R12.1
  Top Layer w0.762: R10.1 21.84,44.07 21.84,43.18 21.14,42.48 8.74,42.48 8.04,41.78 D5.1 8.02,39.29 C22.2 9.95,37.26 D2.2 ; D17.2 49.26,68.65 C48.2 49.24,70.6 D14.1 ; D9.2 8.02,68.65 arc(8,68.64) C26.2 7.99,70.66 arc(8,70.68) D6.1 ; D10.1 7.86,6.27 C30.2 7.85,6.22 D13.2 ; D21.2 51.42,37.27 C50.2 49.44,39.24 D18.1 49.39,41.93 50.64,43.18 55.14,43.18 56.04,44.08 56.04,45.77 C45.1
GND: length 39
  Top Layer w0.508: v1(63.64,22.58) 63.17,22.58 ; v1(59.54,21.98) 59.81,22.24
  Top Layer w0.762: v1(59.54,21.98) v1(59.54,20.98) v1(59.54,19.38) 57.81,19.38 v1(57.8,19.39) v1(55.25,19.39) v1(55.25,18.15) v1(55.25,16.78) v1(54.14,16.78) v1(54.14,15.4) v1(54.14,13.98) v1(56.86,13.98) v1(58.54,13.98) v1(59.94,13.98) v1(61.36,13.98) v1(62.94,13.98) v1(64.49,13.98) v1(66.12,13.98) 66.88,13.98 66.97,14.08 v1(66.97,21.06) v1(66.97,22.58) v1(64.95,22.58) v1(63.64,22.58)
  vias: v1(1.74,52.58) v1(1.74,51.58) v1(1.74,50.58) v1(1.84,41.58) v1(1.84,40.58) v1(1.84,39.58) v1(1.94,84.18) v1(1.94,83.18) v1(1.94,82.18) v1(1.94,21.58) v1(1.94,20.58) v1(1.94,19.58) v1(1.94,10.68) v1(1.94,9.68) v1(1.94,8.68) v1(2.34,72.28) v1(2.34,71.28) v1(2.34,70.28) v1(2.79,52.58) v1(2.79,51.58) v1(2.79,50.58) v1(2.99,84.18) v1(2.99,83.18) v1(2.99,82.18) v1(2.89,41.58) v1(2.89,40.58) v1(2.89,39.58) v1(2.99,21.58) v1(2.99,20.58) v1(2.99,19.58) v1(2.99,10.68) v1(2.99,9.68) v1(2.99,8.68) v1(3.39,72.28) v1(3.39,71.28) v1(3.39,70.28) v1(3.84,52.58) v1(3.84,51.58) v1(3.84,50.58) v1(3.94,41.58) v1(3.94,40.58) v1(3.94,39.58) v1(4.04,84.18) v1(4.04,83.18) v1(4.04,82.18) v1(4.04,21.58) v1(4.04,20.58) v1(4.04,19.58) v1(4.04,10.68) v1(4.04,9.68) v1(4.04,8.68) v1(4.44,72.28) v1(4.44,71.28) v1(4.44,70.28) v1(35.64,72.58) v1(35.64,71.58) v1(35.64,70.58) v1(35.64,52.98) v1(35.64,51.98) v1(35.64,50.98) v1(35.74,21.58) v1(35.74,20.58) v1(35.74,19.58) v1(35.84,41.58) v1(35.84,40.58) v1(35.84,39.58) v1(35.84,10.38) v1(35.84,9.38) v1(35.84,8.38) v1(36.04,84.08) v1(36.04,83.08) v1(36.04,82.08) v1(36.69,72.58) v1(36.69,71.58) v1(36.69,70.58) v1(36.69,52.98) v1(36.69,51.98) v1(36.69,50.98) v1(36.79,21.58) v1(36.79,20.58) v1(36.79,19.58) v1(36.89,41.58) v1(36.89,40.58) v1(36.89,39.58) v1(36.89,10.38) v1(36.89,9.38) v1(36.89,8.38) v1(37.09,84.08) v1(37.09,83.08) v1(37.09,82.08) v1(37.74,72.58) v1(37.74,71.58) v1(37.74,70.58) v1(37.74,52.98) v1(37.74,51.98) v1(37.74,50.98) v1(37.84,21.58) v1(37.84,20.58) v1(37.84,19.58) v1(37.94,41.58) v1(37.94,40.58) v1(37.94,39.58) v1(37.94,10.38) v1(37.94,9.38) v1(37.94,8.38) v1(38.11,91.98) v1(38.14,84.08) v1(38.14,83.08) v1(38.14,82.08) v1(38.61,91.52) v1(39.14,90.94) v1(39.51,90.38) v1(43.24,53.08) v1(43.24,52.08) v1(43.24,51.08) v1(43.24,41.68) v1(43.24,40.68) v1(43.24,39.68) v1(43.44,84.28) v1(43.44,83.28) v1(43.44,82.28) v1(43.44,73.08) v1(43.44,72.08) v1(43.44,71.08) v1(44.29,53.08) v1(44.29,52.08) v1(44.29,51.08) v1(44.29,41.68) v1(44.29,40.68) v1(44.29,39.68) v1(44.49,84.28) v1(44.49,83.28) v1(44.49,82.28) v1(44.49,73.08) v1(44.49,72.08) v1(44.49,71.08) v1(45.34,53.08) v1(45.34,52.08) v1(45.34,51.08) v1(45.34,41.68) v1(45.34,40.68) v1(45.34,39.68) v1(45.54,84.28) v1(45.54,83.28) v1(45.54,82.28) v1(45.54,73.08) v1(45.54,72.08) v1(45.54,71.08) v1(48.94,21.78) v1(48.94,20.78) v1(48.94,19.78) v1(48.94,18.78) v1(48.94,17.78) v1(48.94,16.78) v1(48.94,15.78) v1(48.94,14.78) v1(48.94,13.78) v1(48.94,12.78) v1(48.94,11.78) v1(48.94,10.78) v1(48.94,9.88) v1(48.94,8.88) v1(48.94,7.88) v1(49.99,21.78) v1(49.99,20.78) v1(49.99,19.78) v1(49.99,18.78) v1(49.99,17.78) v1(49.99,16.78) v1(49.99,15.78) v1(49.99,14.78) v1(49.99,13.78) v1(49.99,12.78) v1(49.99,11.78) v1(49.99,10.78) v1(49.99,9.88) v1(49.99,8.88) v1(49.99,7.88) v1(51.04,21.78) v1(51.04,20.78) v1(51.04,19.78) v1(51.04,18.78) v1(51.04,17.78) v1(51.04,16.78) v1(51.04,15.78) v1(51.04,14.78) v1(51.04,13.78) v1(51.04,12.78) v1(51.04,11.78) v1(51.04,10.78) v1(51.04,9.88) v1(51.04,8.88) v1(51.04,7.88) v1(60.04,22.48) v1(62.94,22.58) v1(63.34,45.18) v1(67.04,18.98) v1(67.04,16.68) v1(67.04,14.48) v1(69.74,22.08) v1(69.74,21.08) v1(69.74,20.08) v1(69.74,19.08) v1(69.74,18.08) v1(69.74,17.08) v1(70.79,22.08) v1(70.79,21.08) v1(70.79,20.08) v1(70.79,19.08) v1(70.79,18.08) v1(70.79,17.08) v1(71.84,22.08) v1(71.84,21.08) v1(71.84,20.08) v1(71.84,19.08) v1(71.84,18.08) v1(71.84,17.08) v1(77.44,52.98) v1(77.44,51.98) v1(77.44,50.98) v1(77.44,41.68) v1(77.44,40.68) v1(77.44,39.68) v1(77.54,84.08) v1(77.54,83.08) v1(77.54,82.08) v1(77.54,73.18) v1(77.54,72.18) v1(77.54,71.18) v1(78.49,52.98) v1(78.49,51.98) v1(78.49,50.98) v1(78.49,41.68) v1(78.49,40.68) v1(78.49,39.68) v1(78.59,84.08) v1(78.59,83.08) v1(78.59,82.08) v1(78.59,73.18) v1(78.59,72.18) v1(78.59,71.18) v1(79.54,52.98) v1(79.54,51.98) v1(79.54,50.98) v1(79.54,41.68) v1(79.54,40.68) v1(79.54,39.68) v1(79.64,84.08) v1(79.64,83.08) v1(79.64,82.08) v1(79.64,73.18) v1(79.64,72.18) v1(79.64,71.18)
$1N3424: length 11.5
  Top Layer w0.508: R10.2 15.85,44.07 15.14,44.78 15.14,45.63 C3.1 C4.1 16.68,46.13 U7.4
$1N4804: length 12.6
  Top Layer w0.508: R2.2 R17.1 14.5,51.42 15.15,50.77 C7.2 17.43,47.4 U7.3
$1N4936: length 5.6
  Top Layer w0.508: 2.56,46.15 7.33,46.15 R1.1
$1N6332: length 25.2
  Top Layer w0.508: C1.2 19.82,52.9 19.04,53.68 6.24,53.68 5.64,53.08 5.64,49.98 6.24,49.38 7.84,49.38 R2.1 R1.2 R13.2
$1N6624: length 28.7
  Top Layer w0.508: H1.2 36.86,46.26 U12.5 ; 32.34,46.08 31.84,45.58 31.84,43.88 31.34,43.38 27.04,43.38 26.56,43.86 C34.2 25.06,47.4 U7.6 23.7,47.38 22.44,47.38 21.82,48 21.82,48.72 ; U7.2 21.78,48.67 21.82,48.72 ; 21.82,48.72 C1.1
$1N7112: length 5.3
  Top Layer w0.508: 2.28,77.68 6.74,77.68 R3.1
$1N7126: length 23.9
  Top Layer w0.381: 7.33,81 7.21,80.88 5.94,80.88 5.44,81.38 5.44,84.28 6.54,85.38 18.7,85.38 C8.2
  Top Layer w0.508: R4.1 7.33,81 R3.2 R14.2
$1N7131: length 8.8
  Top Layer w0.508: U14.4 15.32,78.08 C12.1 14.75,78.61 C10.1 17.58,76.55 R11.2
$1N7132: length 18.3
  Top Layer w0.508: C9.2 v1(16.09,79.35) U14.3 ; R4.2 R18.1 v1(9.45,84.38)
  Bottom Layer w0.508: v1(9.45,84.38) 15.44,84.38 16.14,83.68 16.14,79.39 v1(16.09,79.35)
$1N7147: length 18.2
  Top Layer w0.508: v1(29.24,78.68) 27.99,78.68 R5.1 ; R6.2 14.89,82.74 17.02,80.62 U14.2 v1(19.64,80.62)
  Bottom Layer w0.508: v1(19.64,80.62) 19.64,79.38 20.34,78.68 v1(29.24,78.68)
$1N7158: length 27.9
  Top Layer w0.508: U16.5 36.96,77.84 H2.2 31.74,77.79 31.74,74.78 30.94,73.98 26.64,73.98 25.89,74.73 C36.2 25.95,76.59 R5.2 25.24,79.35 U14.6 22.07,79.35 21.47,79.95 21.47,84.02
$1N8120: length 5.1
  Top Layer w0.508: R7.1 7.48,15.05 U18.5
$1N8133: length 6
  Top Layer w0.508: C15.2 R9.1 R8.1 7.72,18.79 R7.2
$1N8137: length 18
  Top Layer w0.508: v1(18.14,22.18) 19.39,22.18 C14.2 19.54,22.03 19.54,19.38 18.91,18.75 U17.2 ; R8.2 v1(7.72,22.18)
  Bottom Layer w0.508: v1(7.72,22.18) v1(18.14,22.18)
$1N8145: length 37.3
  Top Layer w0.508: R9.2 9.77,22.81 10.64,23.68 21.04,23.68 21.54,23.18 21.54,22.09 C14.1 21.51,17.91 21.94,17.48 U17.6 25.22,17.48 C35.2 26.27,14.95 26.64,14.58 30.91,14.58 H3.2 36.7,15.01 U19.5
$1N8408: length 9.7
  Top Layer w0.508: R12.2 15.16,14.23 C16.1 ; 14.77,14.62 14.88,14.74 C18.1 15.22,16.21 U17.4
$1N8595: length 5.4
  Top Layer w0.508: U17.3 15.99,17.48 R16.2 R15.2
$1N9380: length 12.1
  Top Layer w0.762: NOREF#7.2 17.4,36.16 CN24.2 CN24.1 13.65,34.94 D2.1
$1N9382: length 2
  Top Layer w0.762: R20.2 27.88,39.39 27.82,39.34
$1N9385: length 12
  Top Layer w0.762: NOREF#12.3 22.48,36.11 CN24.5 CN24.6 29.81,34.93 D1.2
$1N9388: length 2
  Top Layer w0.762: R19.2 12.23,39.32 D5.2
$1N9874: length 1.9
  Top Layer w0.762: D6.2 12.07,70.7 arc(12.08,70.69) 12.08,70.69
$1N9876: length 2
  Top Layer w0.762: R22.2 27.97,70.66 arc(27.95,70.67) D7.2
$1N9882: length 12.6
  Top Layer w0.762: NOREF#11.3 22.51,67.55 CN25.5 29.88,66.35 arc(29.89,66.35) D8.2
$1N9884: length 12.7
  Top Layer w0.762: NOREF.2 17.43,67.57 CN25.2 10.06,66.35 arc(10.03,66.34) D9.1
$1N10335: length 2.1
  Top Layer w0.762: D10.2 12.12,8.31 R23.2
$1N10337: length 2.1
  Top Layer w0.762: R24.2 28,8.21 27.92,8.3
$1N10343: length 12.3
  Top Layer w0.762: D12.2 29.87,3.89 CN26.6 CN26.5 22.48,5.09 NOREF#13.3
$1N10345: length 12.3
  Top Layer w0.762: D13.1 9.85,3.89 CN26.1 CN26.2 17.4,5.1 NOREF#10.2
$1N11433: length 26.2
  Top Layer w0.508: R33.1 68.97,48.08 70.24,48.08 70.7,47.62 70.7,44.34 69.74,43.38 61.25,43.38 60.74,43.89 60.74,48.98 60.08,49.64 U25.2 56.37,49.64 C42.2
$1N11438: length 7.5
  Top Layer w0.508: R30.2 R32.2 53.08,51.33 C47.1 C42.1
$1N11444: length 7.2
  Top Layer w0.508: U23.5 47.83,46.17 48.94,47.28 48.94,49.28 R30.1
$1N11467: length 31.2
  Top Layer w0.508: C47.2 60.64,52.18 61.44,51.38 61.44,49.48 62.55,48.37 U25.6 66.62,48.37 R33.2 C53.2 v1(66.94,44.58) ; H5.2 73.53,46.12 U24.5
  Bottom Layer w0.508: H5.2 72.74,45.38 71.94,44.58 v1(66.94,44.58)
$1N11477: length 44.2
  Top Layer w0.508: C37.1 53.74,82.67 53.74,87.08 ; R26.1 70.37,77.91 71.14,78.68 71.14,85.98 70.04,87.08 53.74,87.08 ; R25.2 49.04,84.16 U13.1 49.94,85.1 49.94,86.48 50.54,87.08 53.74,87.08
$1N11484: length 7.8
  Top Layer w0.508: R29.1 R28.2 60.48,80.12 60.14,79.78 59,79.78 U22.2
$1N11488: length 29.1
  Top Layer w0.508: R29.2 62.44,82.55 62.44,79.48 63.38,78.55 U22.6 66.41,78.55 R26.2 67.04,75.89 C52.2 67.05,74.47 67.54,73.98 72.74,73.98 73.24,74.48 H4.2 73.95,77.62 78.53,77.62
$1N11503: length 8.9
  Top Layer w0.508: U22.3 57.79,78.55 R27.2 C37.2 56.4,83.72 U13.3
$1N11520: length 6
  Top Layer w0.508: C2.1 51.14,83.72 U13.2
$1N11527: length 4.9
  Top Layer w0.508: U20.5 49,77.64 R25.1
$1N11915: length 12.9
  Top Layer w0.762: D16.2 71.51,66.28 CN27.6 CN27.5 64.08,67.44 NOREF#2.3
$1N11916: length 13
  Top Layer w0.762: NOREF#5.2 59,67.53 CN27.2 CN27.1 51.37,66.28 D17.1
$1N11925: length 2.1
  Top Layer w0.762: R34.2 53.53,70.63 D14.2
$1N11929: length 2
  Top Layer w0.762: D15.2 69.7,70.6 R35.2
$1N12302: length 12.8
  Top Layer w0.762: D20.2 71.64,34.91 CN28.6 CN28.5 64.03,36.12 NOREF#4.3
$1N12303: length 12.7
  Top Layer w0.762: D21.1 51.44,34.91 CN28.1 CN28.2 58.95,36.12 NOREF#9.2
$1N12312: length 2.1
  Top Layer w0.762: D18.2 53.63,39.29 R36.2
$1N12316: length 2.1
  Top Layer w0.762: D19.2 69.64,39.33 R37.2
$1N18614: length 2.3
  Top Layer w0.762: D23.2 58.4,8.98 R38.2
$1N18622: length 24.4
  Top Layer w0.508: U6.3 61.39,22.43 ; 61.39,22.43 61.39,22.63 60.54,23.48 54.74,23.48 53.9,24.32 53.9,27.37 ; 61.39,22.43 62.44,23.48 68.24,23.48 69.14,24.38 69.14,27.23 69.1,27.27
$1N18772: length 13.7
  Top Layer w0.762: CN29.5 CN29.6 72.06,4 73.94,5.88 U28.3
$1N18775: length 9.4
  Top Layer w0.762: D22.2 67.22,8.61 71.13,12.52 U28.2
$1N18865: length 4.6
  Top Layer w0.762: U29.5 78.49,15.06 U28.1

## Copper pours and planes (outline as drawn; the poured copper is in the pictures)
GND on Top Layer: -18.99,104.72 98.62,104.72 98.62,-10.27 -18.99,-10.27
GND on Bottom Layer: -14.62,98.9 91.93,98.9 91.93,-10.85 -14.62,-10.85

Small or netless copper shapes (teardrops, artwork), in the pictures only: 362 on Top Layer, 14 on Bottom Layer

## Text on the board
Top Silkscreen Layer: 电压测试点 | 时钟输出 | 外部电源选择 | -5V | GND | +5V | 四元件SK滤波器 | 六元件SK滤波器 | MFB滤波器 | MFB窄带通滤波器 | SK窄带通滤波器 | 外部时钟源
